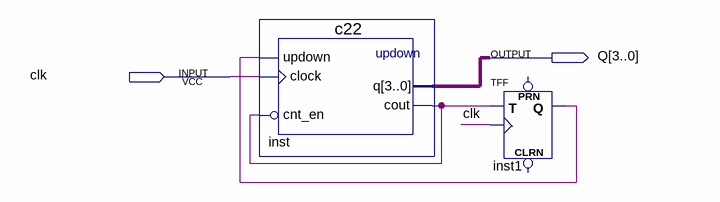
[diagram p0: schematic sheet]
// Quartus schematic p3.bdf as structural Verilog: 2 symbols, 2 pins
module p3 (
  input  clk,
  output [3:0] Q
);

  wire inst1_q, inst_cout;

  c22 inst (.updown(inst1_q), .clock(clk), .cnt_en(~inst_cout), .cout(inst_cout), .q(Q));
  TFF inst1 (.T(inst_cout), .CLK(clk), .Q(inst1_q));  // open: PRN, CLRN
endmodule
